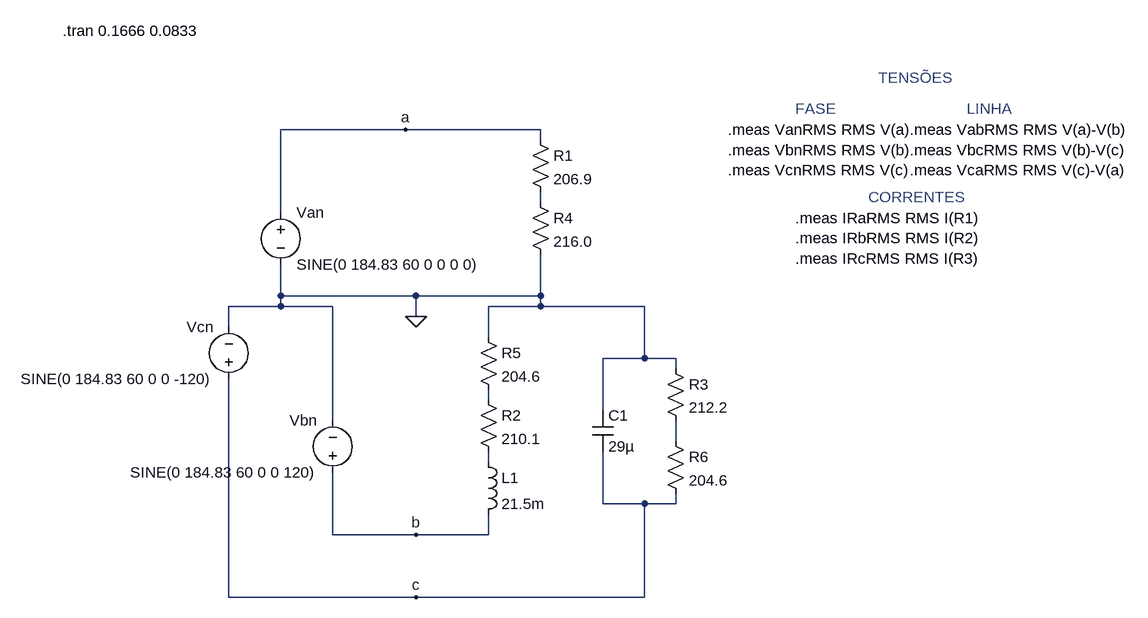
[diagram p0: schematic Y - Y des sem neutro .asc]
Y - Y des sem neutro .asc, the LTspice schematic file:
Version 4.1
SHEET 1 1332 700
WIRE 208 -64 16 -64
WIRE 416 -64 208 -64
WIRE 416 -48 416 -64
WIRE 416 48 416 32
WIRE 16 64 16 -64
WIRE 16 192 16 144
WIRE 224 192 16 192
WIRE 416 192 416 128
WIRE 416 192 224 192
WIRE 16 208 16 192
WIRE 16 208 -64 208
WIRE 96 208 16 208
WIRE 416 208 416 192
WIRE 416 208 336 208
WIRE 576 208 416 208
WIRE 224 224 224 192
WIRE -64 240 -64 208
WIRE 336 256 336 208
WIRE 576 288 576 208
WIRE 576 288 512 288
WIRE 624 288 576 288
WIRE 624 304 624 288
WIRE 336 352 336 336
WIRE 512 368 512 288
WIRE 96 384 96 208
WIRE 624 416 624 384
WIRE 336 448 336 432
WIRE 512 512 512 432
WIRE 576 512 512 512
WIRE 624 512 624 496
WIRE 624 512 576 512
WIRE 96 560 96 464
WIRE 224 560 96 560
WIRE 336 560 336 528
WIRE 336 560 224 560
WIRE -64 656 -64 320
WIRE 224 656 -64 656
WIRE 576 656 576 512
WIRE 576 656 224 656
FLAG 224 224 0
FLAG 208 -64 a
FLAG 224 560 b
FLAG 224 656 c
SYMBOL voltage 16 48 R0
WINDOW 123 0 0 Left 0
WINDOW 39 0 0 Left 0
SYMATTR InstName Van
SYMATTR Value SINE(0 184.83 60 0 0 0 0)
SYMBOL voltage 96 480 R180
WINDOW 0 24 96 Left 2
WINDOW 3 24 16 Left 2
WINDOW 123 0 0 Left 0
WINDOW 39 0 0 Left 0
SYMATTR InstName Vbn
SYMATTR Value SINE(0 184.83 60 0 0 120)
SYMBOL voltage -64 336 R180
WINDOW 0 24 96 Left 2
WINDOW 3 24 16 Left 2
WINDOW 123 0 0 Left 0
WINDOW 39 0 0 Left 0
SYMATTR InstName Vcn
SYMATTR Value SINE(0 184.83 60 0 0 -120)
SYMBOL res 400 -64 R0
SYMATTR InstName R1
SYMATTR Value 206.9
SYMBOL res 400 32 R0
SYMATTR InstName R4
SYMATTR Value 216.0
SYMBOL ind 320 432 R0
SYMATTR InstName L1
SYMATTR Value 21.5m
SYMBOL res 320 336 R0
SYMATTR InstName R2
SYMATTR Value 210.1
SYMBOL res 320 240 R0
SYMATTR InstName R5
SYMATTR Value 204.6
SYMBOL res 608 288 R0
SYMATTR InstName R3
SYMATTR Value 212.2
SYMBOL res 608 400 R0
SYMATTR InstName R6
SYMATTR Value 204.6
SYMBOL cap 496 368 R0
SYMATTR InstName C1
SYMATTR Value 29µ
TEXT -320 -216 Left 2 !.tran 0.1666 0.0833
TEXT 704 -64 Left 2 !.meas VanRMS RMS V(a)\n.meas VbnRMS RMS V(b)\n.meas VcnRMS RMS V(c)
TEXT 936 -144 Left 2 ;TENSÕES
TEXT 808 -96 Left 2 ;FASE
TEXT 1072 -96 Left 2 ;LINHA
TEXT 984 -64 Left 2 !.meas VabRMS RMS V(a)-V(b)\n.meas VbcRMS RMS V(b)-V(c)\n.meas VcaRMS RMS V(c)-V(a)
TEXT 920 40 Left 2 ;CORRENTES
TEXT 808 72 Left 2 !.meas IRaRMS RMS I(R1)\n.meas IRbRMS RMS I(R2)\n.meas IRcRMS RMS I(R3)

The netlist it stands for:
* Y - Y des sem neutro .asc
Van a 0 SINE(0 184.83 60 0 0 0 0)
Vbn b 0 SINE(0 184.83 60 0 0 120)
Vcn c 0 SINE(0 184.83 60 0 0 -120)
R1 a N001 206.9
R4 N001 0 216.0
L1 N004 b 21.5m
R2 N002 N004 210.1
R5 0 N002 204.6
R3 0 N003 212.2
R6 N003 c 204.6
C1 0 c 29µ
.tran 0.1666 0.0833
.meas VanRMS RMS V(a)
.meas VbnRMS RMS V(b)
.meas VcnRMS RMS V(c)
* TENSÕES
* FASE
* LINHA
.meas VabRMS RMS V(a)-V(b)
.meas VbcRMS RMS V(b)-V(c)
.meas VcaRMS RMS V(c)-V(a)
* CORRENTES
.meas IRaRMS RMS I(R1)
.meas IRbRMS RMS I(R2)
.meas IRcRMS RMS I(R3)
.backanno
.end